# Altium project STM3205P.PrjPcb
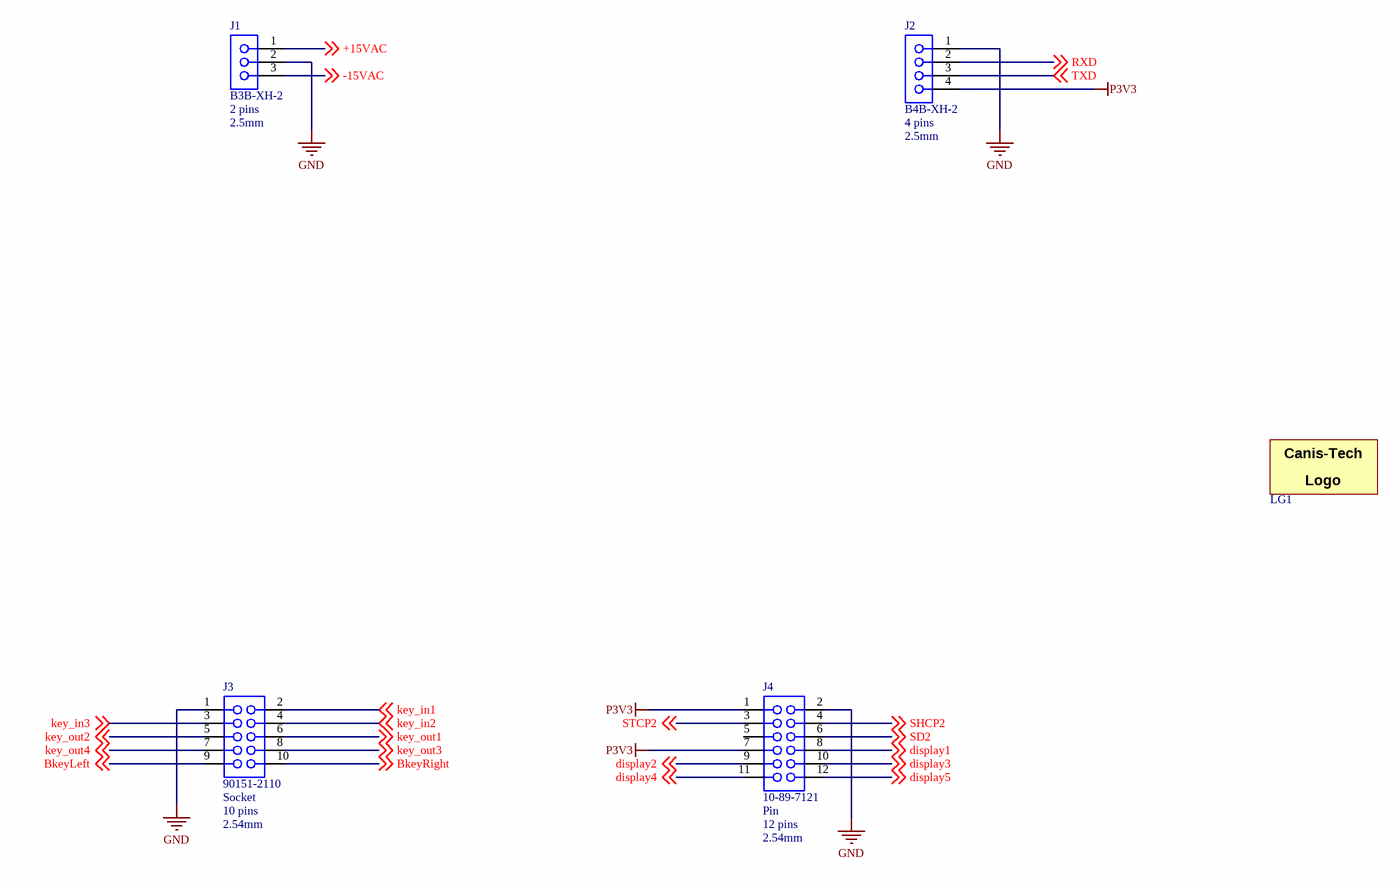
[diagram p0: STM3205P_Connectors.SchDoc]
_Revision: 1.1; _ProjectName: STM3205P; _Engineer: Lucas da Silva; _DrawnBy: Lucas da Silva; _Author: Lucas da Silva; POName: STM3205P
9 sheets, 101 parts. Net scope: global (net labels, ports and power ports of the same name join across sheets).
Board file: STM3205P_PCB.PcbDoc
Sheets:
  STM3205P_Title.SchDoc
  STM3205P_Connectors.SchDoc
  STM3205P_PowerSupply.SchDoc
  STM3205P_Controller.SchDoc
  STM3205P_DACSPI.SchDoc
  STM3205P_VoltageMeasure.SchDoc
  STM3205P_CurrentMeasure.SchDoc
  STM3205P_VoltageControl.SchDoc
  STM3205P_DigitalOutputs.SchDoc

## Sheet STM3205P_Title.SchDoc: =_ProjectName
size A3; Author: Lucas da Silva; DrawnBy: Lucas da Silva; Engineer: Lucas da Silva; Organization: Canis Tech; Address1: -; Address2: -; Address3: -; Address4: Indaiatuba/SP; DocumentNumber: 1; Revision: 1.1; SheetNumber: 1; SheetTotal: 9; Address5: Brazil

### Notes on the sheet
- Rev.
- Description
- Date
- Author
- Page
- Schematic Page
- 1.0
- Project kickoff
- 1
- Title page
- Title
- Checked By
- Variant
- Size:
- Revision:
- A3
- Date:
- Project
- Time:
- Sheet
- of
- File:

## Sheet STM3205P_Connectors.SchDoc
size A3; Author: Lucas da Silva; DrawnBy: Lucas da Silva; Engineer: Lucas da Silva; Organization: Canis Tech; Address1: -; Address2: -; Address3: -; Address4: Indaiatuba/SP; DocumentNumber: 2; Revision: 1.1; SheetNumber: 2; SheetTotal: 9; Address5: Brazil

### Parts
J1  Pins: 2 pins  Pitch: 2.5mm  [CONXH03STRMALE_2.5]  (hidden comment: B3B-XH-2)
J2  Pins: 4 pins  Pitch: 2.5mm  [CONXH04STRMALE_2.5]  (hidden comment: B4B-XH-2)
J3  Type: Socket  Pins: 10 pins  Pitch: 2.54mm  [CONDIL10STRFEMALE_100_100]  (hidden comment: 90151-2110)
J4  Type: Pin  Pins: 12 pins  Pitch: 2.54mm  [CONDIL12STRMALE_100_100]  (hidden comment: 10-89-7121)
LG1  Canis-Tech Logo  [CT Logo 400th]  (value not drawn)  (no BOM)

### Nets
GND: J1.2 J2.1 J3.1 J4.2
P3V3: J2.4 J4.1 J4.7
+15VAC: J1.1 ; off-sheet +15VAC
-15VAC: J1.3 ; off-sheet -15VAC
BkeyLeft: J3.9 ; off-sheet BkeyLeft
BkeyRight: J3.10 ; off-sheet BkeyRight
display1: J4.8 ; off-sheet display1
display2: J4.9 ; off-sheet display2
display3: J4.10 ; off-sheet display3
display4: J4.11 ; off-sheet display4
display5: J4.12 ; off-sheet display5
key_in1: J3.2 ; off-sheet key_in1
key_in2: J3.4 ; off-sheet key_in2
key_in3: J3.3 ; off-sheet key_in3
key_out1: J3.6 ; off-sheet key_out1
key_out2: J3.5 ; off-sheet key_out2
key_out3: J3.8 ; off-sheet key_out3
key_out4: J3.7 ; off-sheet key_out4
RXD: J2.2 ; off-sheet RXD
SD2: J4.6 ; off-sheet SD2
SHCP2: J4.4 ; off-sheet SHCP2
STCP2: J4.3 ; off-sheet STCP2
TXD: J2.3 ; off-sheet TXD

Not connected (* = marked no-connect by the designer): J4 5

### Notes on the sheet
- Title
- Author
- Checked By
- Variant
- Size:
- Revision:
- A3
- Date:
- Project
- Time:
- Sheet
- of
- File:
- (in symbol Canis-Tech Logo) Canis-Tech; Logo

### Library data of the parts
J1 = B3B-XH-2: XH Connector 3 POS HDR VERT 2.5mm; Manufacturer1: JST; LastRevisionNote: Created; Gender: Male; Published: 04-Oct-2025; LatestRevisionDate: 04-Oct-2025; PackageReference: CONXH03STRMALE_2.5; Publisher: Lucas Moraes; PackageDescription: CONXH03STRMALE_2.5; 3 Leads; Type: Pin; PartNumber1: B3B-XH-2
J2 = B4B-XH-2: XH Connector 4 POS HDR VERT 2.5mm; Manufacturer1: JST; LastRevisionNote: Created; Gender: Male; Published: 04-Oct-2025; LatestRevisionDate: 04-Oct-2025; PackageReference: CONXH04STRMALE_2.5; Publisher: Lucas Moraes; PackageDescription: CONXH04STRMALE_2.5; 4 Leads; Type: Pin; PartNumber1: B4B-XH-2
J3 = 90151-2110: Headers & Wire Housings C-Grid PCB Conn Dual Row Vertical 10Ckt; Manufacturer1: Molex; LastRevisionNote: Created; Gender: Female; Direction: 90; Published: 03-Jan-2025; LatestRevisionDate: 03-Jan-2025; PackageReference: CONDIL10STRFEMALE_100_100; Publisher: Lucas Moraes; PackageDescription: CONDIL10STRFEMALE_100_100; 10 Leads; PartNumber1: 90151-2110
J4 = 10-89-7121: Headers & Wire Housings C-Grid PCB Conn SR V onn SR Vt Tn-A 12Ckt; Manufacturer1: Molex; LastRevisionNote: Created; Gender: Male; Direction: 180; Published: 15-Sep-2017; LatestRevisionDate: 15-Sep-2017; PackageReference: CONDIL12; Publisher: Lucas Moraes; PackageDescription: CONDIL12; 12 Leads; PartNumber1: 10-89-7121
LG1 = Canis-Tech Logo: Published: 14-Jul-2023; LatestRevisionDate: 14-Jul-2023; PackageReference: SEW Logo 100th; Publisher: Lucas Moraes; PackageDescription: SEW Logo 100th; No Leads

## Sheet STM3205P_PowerSupply.SchDoc
size A3; Author: Lucas da Silva; DrawnBy: Lucas da Silva; Engineer: Lucas da Silva; Organization: Canis Tech; Address1: -; Address2: -; Address3: -; Address4: Indaiatuba/SP; DocumentNumber: 3; Revision: 1.1; SheetNumber: 3; SheetTotal: 9; Address5: Brazil
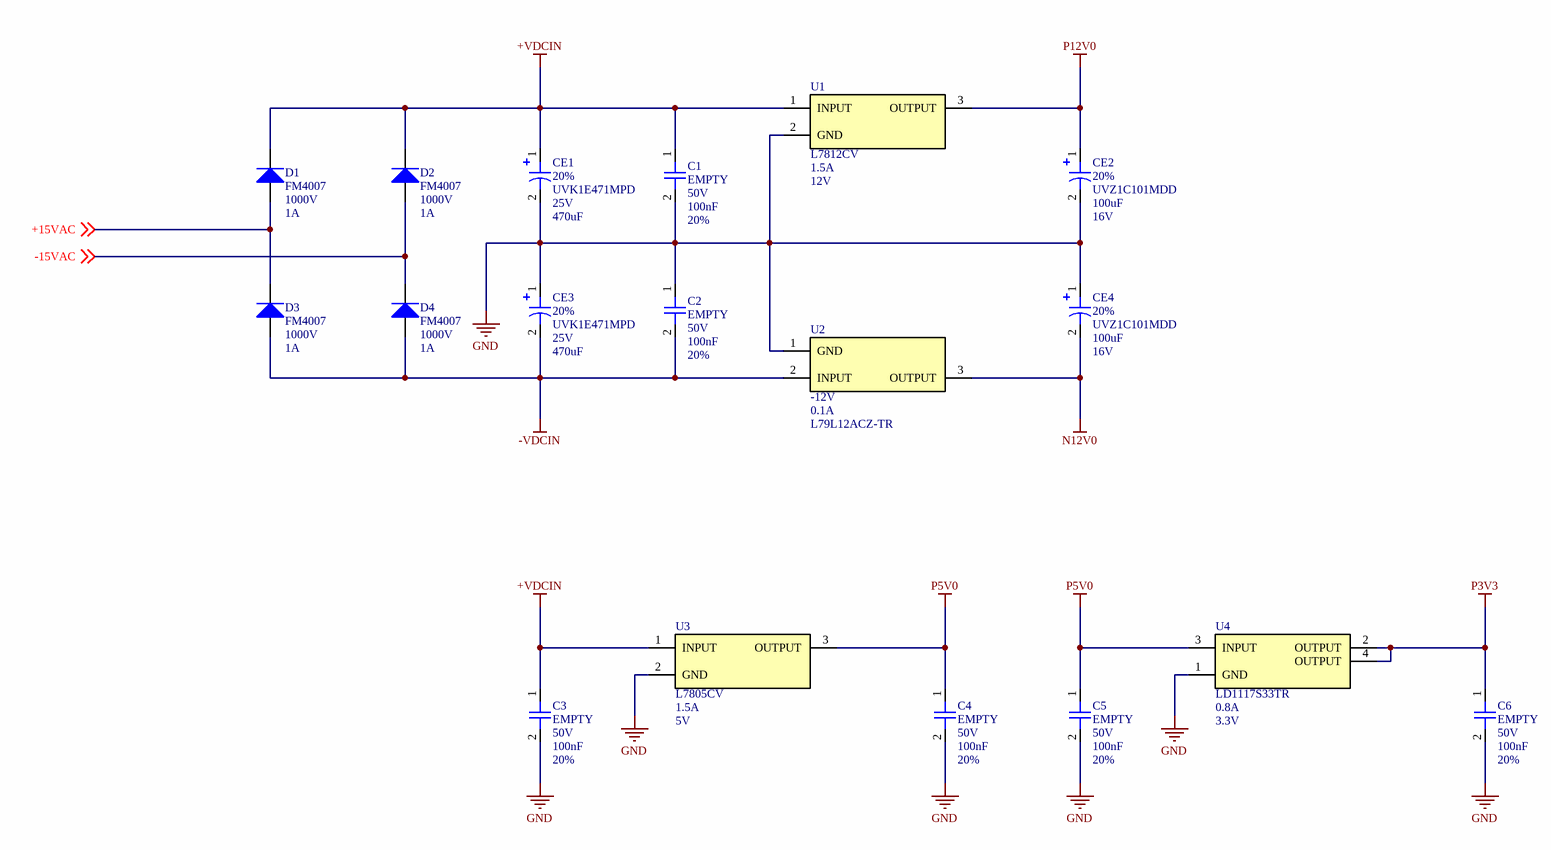
[diagram p1: STM3205P_PowerSupply.SchDoc]

### Parts
C1  value 100nF  PartNumber1: EMPTY  Voltage: 50V  Tolerance: 20%  [CAP0603]  (hidden comment: CC0603)
C2  value 100nF  PartNumber1: EMPTY  Voltage: 50V  Tolerance: 20%  [CAP0603]  (hidden comment: CC0603)
C3  value 100nF  PartNumber1: EMPTY  Voltage: 50V  Tolerance: 20%  [CAP0603]  (hidden comment: CC0603)
C4  value 100nF  PartNumber1: EMPTY  Voltage: 50V  Tolerance: 20%  [CAP0603]  (hidden comment: CC0603)
C5  value 100nF  PartNumber1: EMPTY  Voltage: 50V  Tolerance: 20%  [CAP0603]  (hidden comment: CC0603)
C6  value 100nF  PartNumber1: EMPTY  Voltage: 50V  Tolerance: 20%  [CAP0603]  (hidden comment: CC0603)
CE1  value 470uF  Tolerance: 20%  PartNumber1: UVK1E471MPD  Voltage: 25V  [5.0-10.0-12.5]  (hidden comment: 25V 470uF)
CE2  value 100uF  Tolerance: 20%  PartNumber1: UVZ1C101MDD  Voltage: 16V  [2.0-5.0-11.0]  (hidden comment: 16V 100uF)
CE3  value 470uF  Tolerance: 20%  PartNumber1: UVK1E471MPD  Voltage: 25V  [5.0-10.0-12.5]  (hidden comment: 25V 470uF)
CE4  value 100uF  Tolerance: 20%  PartNumber1: UVZ1C101MDD  Voltage: 16V  [2.0-5.0-11.0]  (hidden comment: 16V 100uF)
D1  Vrrm: 1000V  If: 1A  [DO-214AC]  (hidden comment: FM4007)
D2  Vrrm: 1000V  If: 1A  [DO-214AC]  (hidden comment: FM4007)
D3  Vrrm: 1000V  If: 1A  [DO-214AC]  (hidden comment: FM4007)
D4  Vrrm: 1000V  If: 1A  [DO-214AC]  (hidden comment: FM4007)
U1  Current: 1.5A  Voltage: 12V  [TO-220A]  (hidden comment: L7812CV)
U2  Voltage: -12V  Current: 0.1A  [TO-92A_2.5]  (hidden comment: L79L12ACZ-TR)
U3  Current: 1.5A  Voltage: 5V  [TO-220A]  (hidden comment: L7805CV)
U4  Current: 0.8A  Voltage: 3.3V  [SOT-223]  (hidden comment: LD1117S33TR)

### Nets
+VDCIN: C1.1 C3.1 CE1.1 D1.K D2.K U1.1(INPUT) U3.1(INPUT)
-VDCIN: C2.2 CE3.2 D3.A D4.A U2.2(INPUT)
GND: C1.2 C2.1 C3.2 C4.2 C5.2 C6.2 CE1.2 CE2.2 CE3.1 CE4.1 U1.2(GND) U2.1(GND) U3.2(GND) U4.1(GND)
N12V0: CE4.2 U2.3(OUTPUT)
P3V3: C6.1 U4.2(OUTPUT) U4.4(OUTPUT)
P5V0: C4.1 C5.1 U3.3(OUTPUT) U4.3(INPUT)
P12V0: CE2.1 U1.3(OUTPUT)
+15VAC: D1.A D3.K ; off-sheet +15VAC
-15VAC: D2.A D4.K ; off-sheet -15VAC

### Notes on the sheet
- Title
- Author
- Checked By
- Variant
- Size:
- Revision:
- A3
- Date:
- Project
- Time:
- Sheet
- of
- File:

### Library data of the parts
C1-C6 = CC0603: Surface Mount Multilayer Ceramic Chip Capacitors  for Commercial Applications; Manufacturer1: Yageo; Published: 19-Jun-2016; LatestRevisionDate: 19-Jun-2016; Publisher: Lucas Moraes; PackageReference: CAP0603; PackageDescription: CAP0603;2 Leads
CE1 CE3 = 25V 470uF: Electrolytic Capacitor PTH; Manufacturer1: Nichicon; Code: 471; Published: 24-Aug-2025; LatestRevisionDate: 24-Aug-2025; Publisher: Lucas Moraes; LatestRevisionNote: Created; PackageReference: 5.0-10.0-12.5; PackageDescription: 5.0-10.0-12.5;2 Leads
CE2 CE4 = 16V 100uF: Electrolytic Capacitor PTH; Manufacturer1: Nichicon; Code: 101; Published: 26-Dec-2016; LatestRevisionDate: 26-Dec-2016; PackageReference: 2-5; Publisher: Lucas Moraes; PackageDescription: 2-5;2 leads; LatestRevisionNote: Created
D1-D4 = FM4007: General Purpose Plastic Rectifier; Manufacturer1: Rectron; Vf: 1.1V; Published: 25-Feb-2019; LatestRevisionDate: 25-Feb-2019; PackageReference: DO-214AC; Publisher: Lucas Moraes; PackageDescription: DO-214AC; 2 Leads; PartNumber1: FM4007
U1 = L7812CV: Positive voltage regulator ICs; Manufacturer1: STMicroelectronics; Published: 29-May-2016; LatestRevisionDate: 25-Jun-2023; LatestRevisionNote: Created; PackageReference: TO220A; Publisher: Lucas Moraes; PackageDescription: TO220A;3 Leads; PartNumber1: L7812CV
U2 = L79L12ACZ-TR: Negative voltage regulator ICs; Manufacturer1: STMicroelectronics; Published: 17-Aug-2025; LatestRevisionDate: 17-Aug-2025; LatestRevisionNote: Created; PackageReference: TO-92; Publisher: Lucas Moraes; PackageDescription: TO-92;3 Leads; PartNumber1: L79L12ACZ-TR
U3 = L7805CV: Positive voltage regulator ICs; Manufacturer1: STMicroelectronics; Published: 29-May-2016; LatestRevisionDate: 25-Jun-2023; LatestRevisionNote: Created; PackageReference: TO220A; Publisher: Lucas Moraes; PackageDescription: TO220A;3 Leads; PartNumber1: L7805CV
U4 = LD1117S33TR: Positive voltage regulator ICs; Manufacturer1: STMicroelectronics; Published: 20-Sep-2019; LatestRevisionDate: 20-Sep-2019; LatestRevisionNote: Created; PackageReference: SOT-223; Publisher: Lucas Moraes; PackageDescription: SOT-223;3 Leads; PartNumber1: LD1117S33TR

## Sheet STM3205P_Controller.SchDoc
size A3; Author: Lucas da Silva; DrawnBy: Lucas da Silva; Engineer: Lucas da Silva; Organization: Canis Tech; Address1: -; Address2: -; Address3: -; Address4: Indaiatuba/SP; DocumentNumber: 4; Revision: 1.1; SheetNumber: 4; SheetTotal: 9; Address5: Brazil
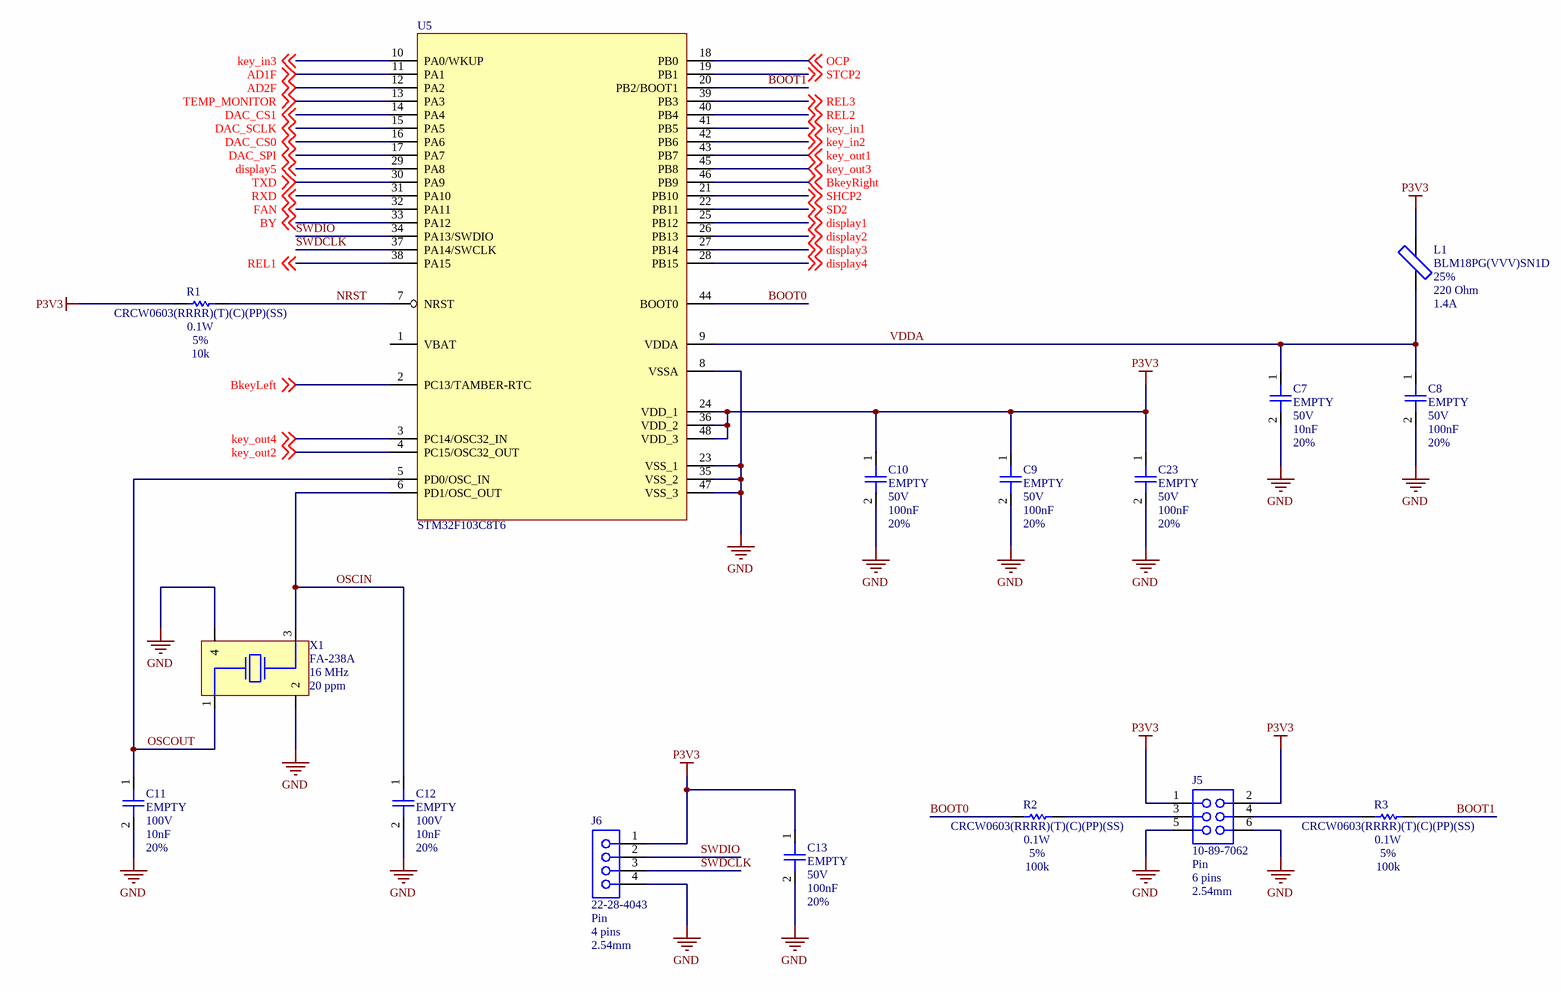
[diagram p2: STM3205P_Controller.SchDoc]

### Parts
C7  value 10nF  PartNumber1: EMPTY  Voltage: 50V  Tolerance: 20%  [CAP0603]  (hidden comment: CC0603)
C8  value 100nF  PartNumber1: EMPTY  Voltage: 50V  Tolerance: 20%  [CAP0603]  (hidden comment: CC0603)
C9  value 100nF  PartNumber1: EMPTY  Voltage: 50V  Tolerance: 20%  [CAP0603]  (hidden comment: CC0603)
C10  value 100nF  PartNumber1: EMPTY  Voltage: 50V  Tolerance: 20%  [CAP0603]  (hidden comment: CC0603)
C11  value 10nF  PartNumber1: EMPTY  Voltage: 100V  Tolerance: 20%  [CAP0603]  (hidden comment: CC0603)
C12  value 10nF  PartNumber1: EMPTY  Voltage: 100V  Tolerance: 20%  [CAP0603]  (hidden comment: CC0603)
C13  value 100nF  PartNumber1: EMPTY  Voltage: 50V  Tolerance: 20%  [CAP0603]  (hidden comment: CC0603)
C23  value 100nF  PartNumber1: EMPTY  Voltage: 50V  Tolerance: 20%  [CAP0603]  (hidden comment: CC0603)
J5  Type: Pin  Pins: 6 pins  Pitch: 2.54mm  [CONDIL06STRMALE_100_100]  (hidden comment: 10-89-7062)
J6  Type: Pin  Pins: 4 pins  Pitch: 2.54mm  [CONSIL04STRMALE_100_100]  (hidden comment: 22-28-4043)
L1  value 220 Ohm  PartNumber1: BLM18PG(VVV)SN1D  Tolerance: 25%  Current: 1.4A  [IND0603]  (hidden comment: BLM18)
R1  value 10k  PartNumber1: CRCW0603(RRRR)(T)(C)(PP)(SS)  Power: 0.1W  Tolerance: 5%  [RES0603]  (hidden comment: Chip Resistor)
R2  value 100k  PartNumber1: CRCW0603(RRRR)(T)(C)(PP)(SS)  Power: 0.1W  Tolerance: 5%  [RES0603]  (hidden comment: Chip Resistor)
R3  value 100k  PartNumber1: CRCW0603(RRRR)(T)(C)(PP)(SS)  Power: 0.1W  Tolerance: 5%  [RES0603]  (hidden comment: Chip Resistor)
U5  STM32F103C8T6  [LQFP-48]
X1  value 16 MHz  Tolerance: 20 ppm  [CR3225]  (hidden comment: FA-238A)

### Nets
GND: C7.2 C8.2 C9.2 C10.2 C11.2 C12.2 C13.2 C23.2 J5.5 J5.6 J6.4 U5.8(VSSA) U5.23(VSS_1) U5.35(VSS_2) U5.47(VSS_3) X1.2 X1.4
P3V3: C9.1 C10.1 C13.1 C23.1 J5.1 J5.2 J6.1 L1.2 R1.1 U5.24(VDD_1) U5.36(VDD_2) U5.48(VDD_3)
AD1F: U5.11(PA1) ; off-sheet AD1F
AD2F: U5.12(PA2) ; off-sheet AD2F
BkeyLeft: U5.2(PC13/TAMBER-RTC) ; off-sheet BkeyLeft
BkeyRight: U5.46(PB9) ; off-sheet BkeyRight
BOOT0: R2.1 U5.44(BOOT0)
BOOT1: R3.2 U5.20(PB2/BOOT1)
BY: U5.33(PA12) ; off-sheet BY
DAC_CS0: U5.16(PA6) ; off-sheet DAC_CS0
DAC_CS1: U5.14(PA4) ; off-sheet DAC_CS1
DAC_SCLK: U5.15(PA5) ; off-sheet DAC_SCLK
DAC_SPI: U5.17(PA7) ; off-sheet DAC_SPI
display1: U5.25(PB12) ; off-sheet display1
display2: U5.26(PB13) ; off-sheet display2
display3: U5.27(PB14) ; off-sheet display3
display4: U5.28(PB15) ; off-sheet display4
display5: U5.29(PA8) ; off-sheet display5
FAN: U5.32(PA11) ; off-sheet FAN
key_in1: U5.41(PB5) ; off-sheet key_in1
key_in2: U5.42(PB6) ; off-sheet key_in2
key_in3: U5.10(PA0/WKUP) ; off-sheet key_in3
key_out1: U5.43(PB7) ; off-sheet key_out1
key_out2: U5.4(PC15/OSC32_OUT) ; off-sheet key_out2
key_out3: U5.45(PB8) ; off-sheet key_out3
key_out4: U5.3(PC14/OSC32_IN) ; off-sheet key_out4
NRST: R1.2 U5.7(NRST)
OCP: U5.18(PB0) ; off-sheet OCP
OSCIN: C12.1 U5.6(PD1/OSC_OUT) X1.3
OSCOUT: C11.1 U5.5(PD0/OSC_IN) X1.1
REL1: U5.38(PA15) ; off-sheet REL1
REL2: U5.40(PB4) ; off-sheet REL2
REL3: U5.39(PB3) ; off-sheet REL3
RXD: U5.31(PA10) ; off-sheet RXD
SD2: U5.22(PB11) ; off-sheet SD2
SHCP2: U5.21(PB10) ; off-sheet SHCP2
STCP2: U5.19(PB1) ; off-sheet STCP2
SWDCLK: J6.3 U5.37(PA14/SWCLK)
SWDIO: J6.2 U5.34(PA13/SWDIO)
TEMP_MONITOR: U5.13(PA3) ; off-sheet TEMP_MONITOR
TXD: U5.30(PA9) ; off-sheet TXD
VDDA: C7.1 C8.1 L1.1 U5.9(VDDA)
NetJ5_3: J5.3 R2.2
NetJ5_4: J5.4 R3.1

Not connected (* = marked no-connect by the designer): U5 1(VBAT)

### Notes on the sheet
- Title
- Author
- Checked By
- Variant
- Size:
- Revision:
- A3
- Date:
- Project
- Time:
- Sheet
- of
- File:

### Library data of the parts
C7-C13 C23 = CC0603: as C1 on sheet STM3205P_PowerSupply; Published: 19-Jun-2016; LatestRevisionDate: 19-Jun-2016; Publisher: Lucas Moraes; PackageReference: CAP0603; PackageDescription: CAP0603;2 Leads
J5 = 10-89-7062: Headers & Wire Housings C-Grid PCB Conn SR V onn SR Vt Tn-A 8Ckt; Manufacturer1: Molex; LastRevisionNote: Created; Gender: Male; Direction: 180; Published: 12-Sep-2017; LatestRevisionDate: 12-Sep-2017; PackageReference: CONDIL6; Publisher: Lucas Moraes; PackageDescription: CONDIL6; 6 Leads; PartNumber1: 10-89-7062
J6 = 22-28-4043: Headers & Wire Housings 04 MODII HDR SRST B/A .100CL; Manufacturer1: Molex; LastRevisionNote: Created; Gender: Male; Published: 27-Mar-2023; LatestRevisionDate: 27-Mar-2023; PackageReference: CONSIL04STRMALE_100_100; Publisher: Lucas Moraes; PackageDescription: CONSIL04STRMALE_100_100; 4 Leads; PartNumber1: 22-28-4043
L1 = BLM18: Ferrite Beads 0603; Manufacturer1: Murata Electronics; Code: 221; LatestRevisionDate: 22-Dec-2016; PackageReference: IND0603; Publisher: Lucas Moraes; PackageDescription: IND0603; 2 Leads; Published: 22-Dec-2016
R1-R3 = CRCW0603: Thick Film Chip Resistors with CECC Approval,  available with Established Reliability; Manufacturer1: Vishay; LatestRevisionDate: 06-May-2016; PackageReference: 0603; Publisher: Lucas Moraes; PackageDescription: SMD 0603; 2 Leads; Published: 06-May-2016
U5 = STM32F103C8T6: 32-bit Microcontrollers - ARM Cortex-M0+ 32kB Flash, 6kB RAM; Manufacturer1: STMicroelectronics; Published: 01-May-2024; LatestRevisionDate: 01-May-2024; LatestRevisionNote: Created; PackageReference: LQFP-48; Publisher: Lucas Moraes; PackageDescription: LQFP-48; 48 leads; PartNumber1: STM32F103C8T6
X1 = FA-238A: Crystals FA-238A XTAL MHZ -40 125C 7.0PF 250TR; Manufacturer1: Epson Timing; Published: 03-Dec-2021; LatestRevisionDate: 03-Dec-2021; Publisher: Lucas Moraes; PackageReference: FA-238A; PackageDescription: FA-238A;2 Leads; Datasheet: https://br.mouser.com/datasheet/2/137/FA_238A_en-1649567.pdf; PartNumber1: FA-238A

## Sheet STM3205P_DACSPI.SchDoc
size A3; Author: Lucas da Silva; DrawnBy: Lucas da Silva; Engineer: Lucas da Silva; Organization: Canis Tech; Address1: -; Address2: -; Address3: -; Address4: Indaiatuba/SP; DocumentNumber: 5; Revision: 1.1; SheetNumber: 5; SheetTotal: 9; Address5: Brazil
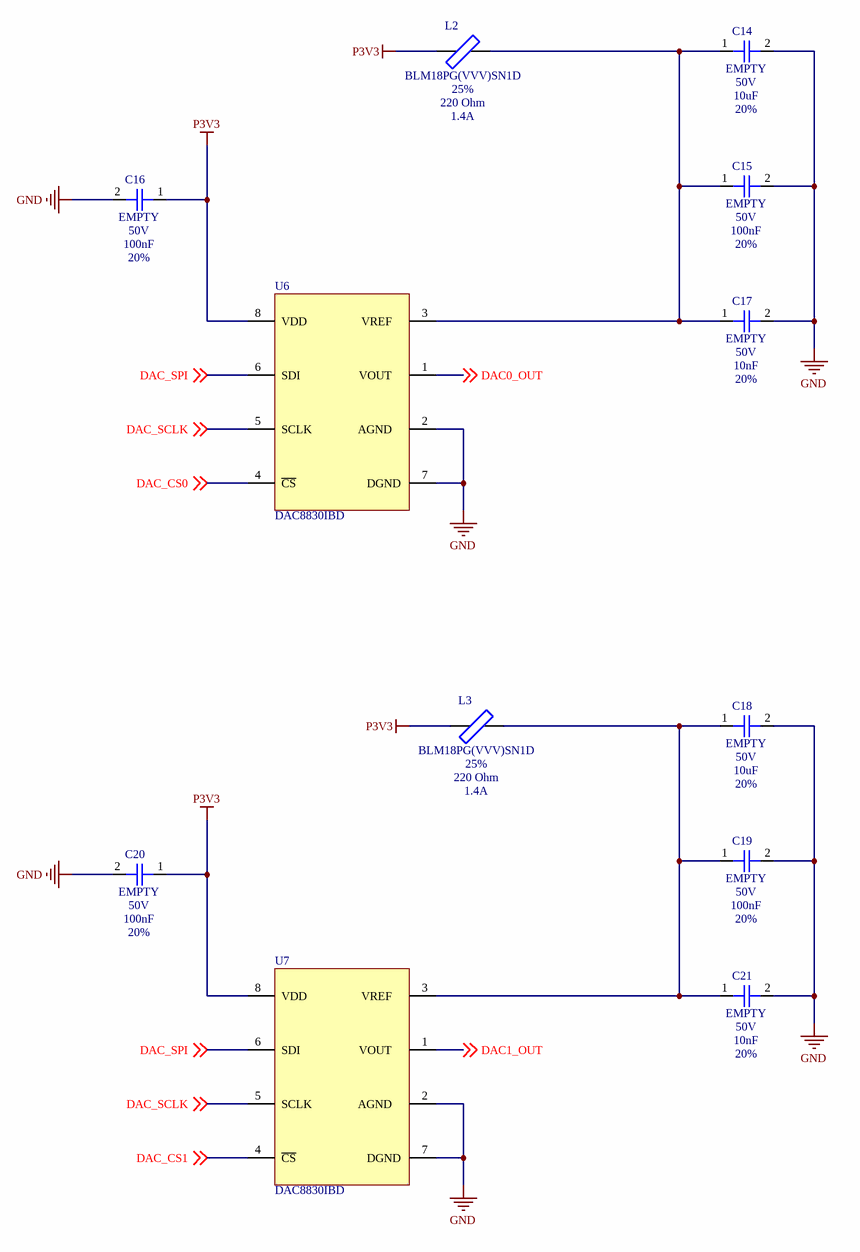
[diagram p3: STM3205P_DACSPI.SchDoc]

### Parts
C14  value 10uF  PartNumber1: EMPTY  Voltage: 50V  Tolerance: 20%  [CAP0603]  (hidden comment: CC0603)
C15  value 100nF  PartNumber1: EMPTY  Voltage: 50V  Tolerance: 20%  [CAP0603]  (hidden comment: CC0603)
C16  value 100nF  PartNumber1: EMPTY  Voltage: 50V  Tolerance: 20%  [CAP0603]  (hidden comment: CC0603)
C17  value 10nF  PartNumber1: EMPTY  Voltage: 50V  Tolerance: 20%  [CAP0603]  (hidden comment: CC0603)
C18  value 10uF  PartNumber1: EMPTY  Voltage: 50V  Tolerance: 20%  [CAP0603]  (hidden comment: CC0603)
C19  value 100nF  PartNumber1: EMPTY  Voltage: 50V  Tolerance: 20%  [CAP0603]  (hidden comment: CC0603)
C20  value 100nF  PartNumber1: EMPTY  Voltage: 50V  Tolerance: 20%  [CAP0603]  (hidden comment: CC0603)
C21  value 10nF  PartNumber1: EMPTY  Voltage: 50V  Tolerance: 20%  [CAP0603]  (hidden comment: CC0603)
L2  value 220 Ohm  PartNumber1: BLM18PG(VVV)SN1D  Tolerance: 25%  Current: 1.4A  [IND0603]  (hidden comment: BLM18)
L3  value 220 Ohm  PartNumber1: BLM18PG(VVV)SN1D  Tolerance: 25%  Current: 1.4A  [IND0603]  (hidden comment: BLM18)
U6  PartNumber1: DAC8830IBD  [SOIC-08-3.9mm]  (hidden comment: DAC8830ICD)
U7  PartNumber1: DAC8830IBD  [SOIC-08-3.9mm]  (hidden comment: DAC8830ICD)

### Nets
GND: C14.2 C15.2 C16.2 C17.2 C18.2 C19.2 C20.2 C21.2 U6.2(AGND) U6.7(DGND) U7.2(AGND) U7.7(DGND)
P3V3: C16.1 C20.1 L2.2 L3.2 U6.8(VDD) U7.8(VDD)
DAC0_OUT: U6.1(VOUT) ; off-sheet DAC0_OUT
DAC1_OUT: U7.1(VOUT) ; off-sheet DAC1_OUT
DAC_CS0: U6.4(~{CS}) ; off-sheet DAC_CS0
DAC_CS1: U7.4(~{CS}) ; off-sheet DAC_CS1
DAC_SCLK: U6.5(SCLK) U7.5(SCLK) ; off-sheet DAC_SCLK
DAC_SPI: U6.6(SDI) U7.6(SDI) ; off-sheet DAC_SPI
NetC14_1: C14.1 C15.1 C17.1 L2.1 U6.3(VREF)
NetC18_1: C18.1 C19.1 C21.1 L3.1 U7.3(VREF)

### Notes on the sheet
- Title
- Author
- Checked By
- Variant
- Size:
- Revision:
- A3
- Date:
- Project
- Time:
- Sheet
- of
- File:

### Library data of the parts
C14-C21 = CC0603: as C1 on sheet STM3205P_PowerSupply; Published: 19-Jun-2016; LatestRevisionDate: 19-Jun-2016; Publisher: Lucas Moraes; PackageReference: CAP0603; PackageDescription: CAP0603;2 Leads
L2 L3 = BLM18: as L1 on sheet STM3205P_Controller; LatestRevisionDate: 22-Dec-2016; PackageReference: IND0603; Publisher: Lucas Moraes; PackageDescription: IND0603; 2 Leads; Published: 22-Dec-2016
U6 U7 = DAC8830ICD: DAC Lo-Pwr R-To-R Output 16-Bit Serial Input; Manufacturer1: Texas Instruments; Published: 02-Apr-2025; LatestRevisionDate: 02-Apr-2025; LatestRevisionNote: Created; PackageReference: SOIC-08-3.9mm; Publisher: Lucas Moraes; PackageDescription: SOIC-08-3.9mm; 8 Leads; Datasheet: https://www.ti.com/lit/ds/symlink/dac8830.pdf

## Sheet STM3205P_VoltageMeasure.SchDoc
size A3; Author: Lucas da Silva; DrawnBy: Lucas da Silva; Engineer: Lucas da Silva; Organization: Canis Tech; Address1: -; Address2: -; Address3: -; Address4: Indaiatuba/SP; DocumentNumber: 6; Revision: 1.1; SheetNumber: 6; SheetTotal: 9; Address5: Brazil
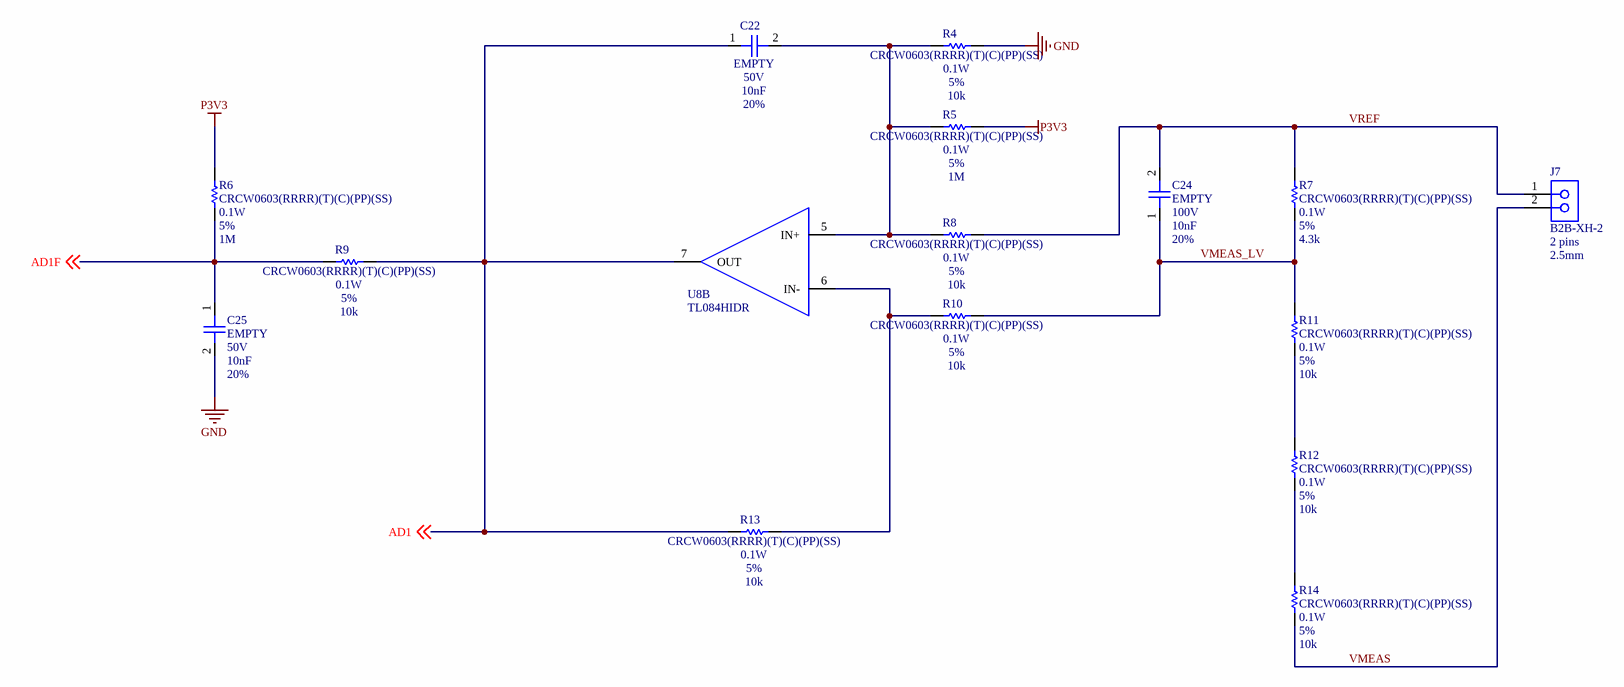
[diagram p4: STM3205P_VoltageMeasure.SchDoc]

### Parts
C22  value 10nF  PartNumber1: EMPTY  Voltage: 50V  Tolerance: 20%  [CAP0603]  (hidden comment: CC0603)
C24  value 10nF  PartNumber1: EMPTY  Voltage: 100V  Tolerance: 20%  [CAP0603]  (hidden comment: CC0603)
C25  value 10nF  PartNumber1: EMPTY  Voltage: 50V  Tolerance: 20%  [CAP0603]  (hidden comment: CC0603)
J7  Pins: 2 pins  Pitch: 2.5mm  [CONXH02STRMALE_2.5]  (hidden comment: B2B-XH-2)
R4  value 10k  PartNumber1: CRCW0603(RRRR)(T)(C)(PP)(SS)  Power: 0.1W  Tolerance: 5%  [RES0603]  (hidden comment: Chip Resistor)
R5  value 1M  PartNumber1: CRCW0603(RRRR)(T)(C)(PP)(SS)  Power: 0.1W  Tolerance: 5%  [RES0603]  (hidden comment: Chip Resistor)
R6  value 1M  PartNumber1: CRCW0603(RRRR)(T)(C)(PP)(SS)  Power: 0.1W  Tolerance: 5%  [RES0603]  (hidden comment: Chip Resistor)
R7  value 4.3k  PartNumber1: CRCW0603(RRRR)(T)(C)(PP)(SS)  Power: 0.1W  Tolerance: 5%  [RES0603]  (hidden comment: Chip Resistor)
R8  value 10k  PartNumber1: CRCW0603(RRRR)(T)(C)(PP)(SS)  Power: 0.1W  Tolerance: 5%  [RES0603]  (hidden comment: Chip Resistor)
R9  value 10k  PartNumber1: CRCW0603(RRRR)(T)(C)(PP)(SS)  Power: 0.1W  Tolerance: 5%  [RES0603]  (hidden comment: Chip Resistor)
R10  value 10k  PartNumber1: CRCW0603(RRRR)(T)(C)(PP)(SS)  Power: 0.1W  Tolerance: 5%  [RES0603]  (hidden comment: Chip Resistor)
R11  value 10k  PartNumber1: CRCW0603(RRRR)(T)(C)(PP)(SS)  Power: 0.1W  Tolerance: 5%  [RES0603]  (hidden comment: Chip Resistor)
R12  value 10k  PartNumber1: CRCW0603(RRRR)(T)(C)(PP)(SS)  Power: 0.1W  Tolerance: 5%  [RES0603]  (hidden comment: Chip Resistor)
R13  value 10k  PartNumber1: CRCW0603(RRRR)(T)(C)(PP)(SS)  Power: 0.1W  Tolerance: 5%  [RES0603]  (hidden comment: Chip Resistor)
R14  value 10k  PartNumber1: CRCW0603(RRRR)(T)(C)(PP)(SS)  Power: 0.1W  Tolerance: 5%  [RES0603]  (hidden comment: Chip Resistor)
U8  TL084HIDR  [SOIC-14-3.9mm]  (part B of 4)

### Nets
GND: C25.2 R4.2
P3V3: R5.2 R6.2
AD1: C22.1 R9.2 R13.1 U8.7(OUT) ; off-sheet AD1
AD1F: C25.1 R6.1 R9.1 ; off-sheet AD1F
VMEAS: J7.2 R14.2
VMEAS_LV: C24.1 R7.2 R10.2 R11.1
VREF: C24.2 J7.1 R7.1 R8.2
NetC22_2: C22.2 R4.1 R5.1 R8.1 U8.5(IN+)
NetR10_1: R10.1 R13.2 U8.6(IN-)
NetR11_2: R11.2 R12.1
NetR12_2: R12.2 R14.1

### Notes on the sheet
- Title
- Author
- Checked By
- Variant
- Size:
- Revision:
- A3
- Date:
- Project
- Time:
- Sheet
- of
- File:

### Library data of the parts
C22 C24 C25 = CC0603: as C1 on sheet STM3205P_PowerSupply; Published: 19-Jun-2016; LatestRevisionDate: 19-Jun-2016; Publisher: Lucas Moraes; PackageReference: CAP0603; PackageDescription: CAP0603;2 Leads
J7 = B2B-XH-2: XH Connector 2 POS HDR VERT 2.5mm; Manufacturer1: JST; LastRevisionNote: Created; Gender: Male; Published: 04-Oct-2025; LatestRevisionDate: 04-Oct-2025; PackageReference: CONXH02STRMALE_2.5; Publisher: Lucas Moraes; PackageDescription: CONXH02STRMALE_2.5; 2 Leads; Type: Pin; PartNumber1: B2B-XH-2
R4-R14 = CRCW0603: as R1 on sheet STM3205P_Controller; LatestRevisionDate: 06-May-2016; PackageReference: 0603; Publisher: Lucas Moraes; PackageDescription: SMD 0603; 2 Leads; Published: 06-May-2016
U8 = TL084HIDR: Quad Operational Amplifiers RRIO; Manufacturer1: Texas Instruments; Published: 27-Aug-2025; LatestRevisionDate: 27-Aug-2025; LatestRevisionNote: Created; PackageReference: SOIC14; Publisher: Lucas Moraes; PackageDescription: SOIC14; 14 Leads; Datasheet: https://www.ti.com/lit/ds/symlink/tl084.pdf; PartNumber1: TL084HIDR

## Sheet STM3205P_CurrentMeasure.SchDoc
size A3; Author: Lucas da Silva; DrawnBy: Lucas da Silva; Engineer: Lucas da Silva; Organization: Canis Tech; Address1: -; Address2: -; Address3: -; Address4: Indaiatuba/SP; DocumentNumber: 7; Revision: 1.1; SheetNumber: 7; SheetTotal: 9; Address5: Brazil
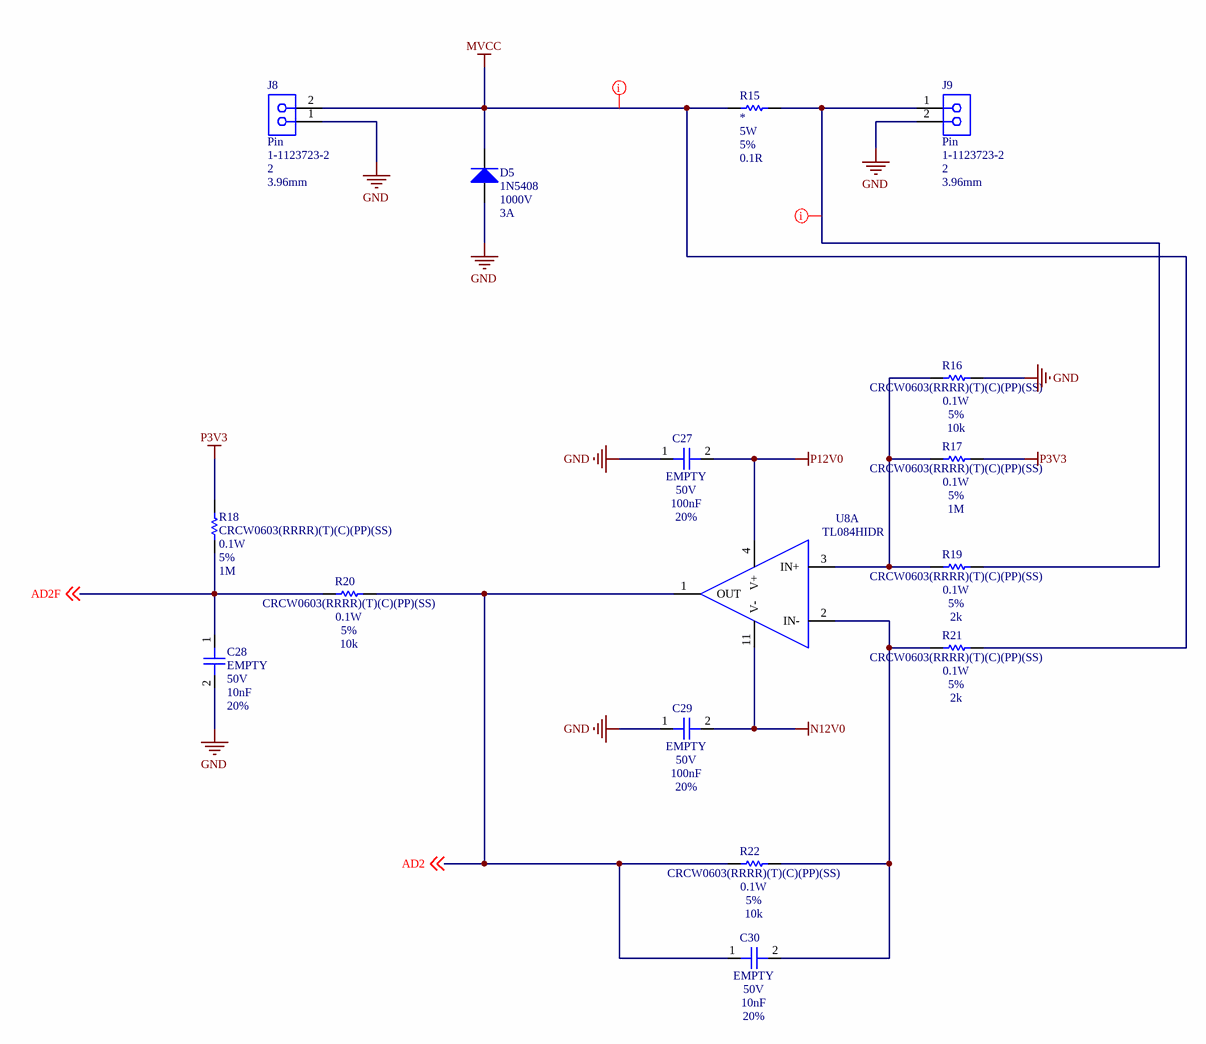
[diagram p5: STM3205P_CurrentMeasure.SchDoc]

### Parts
C27  value 100nF  PartNumber1: EMPTY  Voltage: 50V  Tolerance: 20%  [CAP0603]  (hidden comment: CC0603)
C28  value 10nF  PartNumber1: EMPTY  Voltage: 50V  Tolerance: 20%  [CAP0603]  (hidden comment: CC0603)
C29  value 100nF  PartNumber1: EMPTY  Voltage: 50V  Tolerance: 20%  [CAP0603]  (hidden comment: CC0603)
C30  value 10nF  PartNumber1: EMPTY  Voltage: 50V  Tolerance: 20%  [CAP0603]  (hidden comment: CC0603)
D5  Vrrm: 1000V  If: 3A  [DO-201AD]  (hidden comment: 1N5408)
J8  Type: Pin  Pins: 2  Pitch: 3.96mm  [CONKK02STRMALE_156]  (hidden comment: 1-1123723-2)
J9  Type: Pin  Pins: 2  Pitch: 3.96mm  [CONKK02STRMALE_156]  (hidden comment: 1-1123723-2)
R15  value 0.1R  Power: 5W  Tolerance: 5%  [RESSHUNT]  (hidden comment: Chip Resistor)
R16  value 10k  PartNumber1: CRCW0603(RRRR)(T)(C)(PP)(SS)  Power: 0.1W  Tolerance: 5%  [RES0603]  (hidden comment: Chip Resistor)
R17  value 1M  PartNumber1: CRCW0603(RRRR)(T)(C)(PP)(SS)  Power: 0.1W  Tolerance: 5%  [RES0603]  (hidden comment: Chip Resistor)
R18  value 1M  PartNumber1: CRCW0603(RRRR)(T)(C)(PP)(SS)  Power: 0.1W  Tolerance: 5%  [RES0603]  (hidden comment: Chip Resistor)
R19  value 2k  PartNumber1: CRCW0603(RRRR)(T)(C)(PP)(SS)  Power: 0.1W  Tolerance: 5%  [RES0603]  (hidden comment: Chip Resistor)
R20  value 10k  PartNumber1: CRCW0603(RRRR)(T)(C)(PP)(SS)  Power: 0.1W  Tolerance: 5%  [RES0603]  (hidden comment: Chip Resistor)
R21  value 2k  PartNumber1: CRCW0603(RRRR)(T)(C)(PP)(SS)  Power: 0.1W  Tolerance: 5%  [RES0603]  (hidden comment: Chip Resistor)
R22  value 10k  PartNumber1: CRCW0603(RRRR)(T)(C)(PP)(SS)  Power: 0.1W  Tolerance: 5%  [RES0603]  (hidden comment: Chip Resistor)
U8  TL084HIDR  [SOIC-14-3.9mm]  (part A of 4)

### Nets
GND: C27.1 C28.2 C29.1 D5.A J8.1 J9.2 R16.2
MVCC: D5.K J8.2 R15.2 R21.2
N12V0: C29.2 U8.11(V-)
P3V3: R17.2 R18.2
P12V0: C27.2 U8.4(V+)
AD2: C30.1 R20.2 R22.1 U8.1(OUT) ; off-sheet AD2
AD2F: C28.1 R18.1 R20.1 ; off-sheet AD2F
NetC30_2: C30.2 R21.1 R22.2 U8.2(IN-)
NetJ9_1: J9.1 R15.1 R19.2
NetR16_1: R16.1 R17.1 R19.1 U8.3(IN+)

### Layout directives
net class HighVoltage: MVCC, NetJ9_1

### Notes on the sheet
- Title
- Author
- Checked By
- Variant
- Size:
- Revision:
- A3
- Date:
- Project
- Time:
- Sheet
- of
- File:

### Library data of the parts
C27-C30 = CC0603: as C1 on sheet STM3205P_PowerSupply; Published: 19-Jun-2016; LatestRevisionDate: 19-Jun-2016; Publisher: Lucas Moraes; PackageReference: CAP0603; PackageDescription: CAP0603;2 Leads
D5 = 1N5408: Rectifiers Diode, 1000V, 3A; Manufacturer1: Diotec Semiconductor; Vf: 1.2V; Published: 26-Nov-2022; LatestRevisionDate: 26-Nov-2022; PackageReference: DO-201; Publisher: Lucas Moraes; PackageDescription: DO-201; 2 Leads; PartNumber1: 1N5408
J8 J9 = 1-1123723-2: Header Vert 3.96mm 2Pos; Manufacturer1: TE Connectivity; LastRevisionNote: Created; Gender: Male; Published: 16-Aug-2025; LatestRevisionDate: 16-Aug-2025; PackageReference: CONKK02STRMALE_156; Publisher: Lucas Moraes; PackageDescription: CONKK02STRMALE_156; 2 Leads; PartNumber1: 1-1123723-2
R15 = RESSHUNT: Thick Film Chip Resistors with CECC Approval,  available with Established Reliability; LatestRevisionDate: 18-Agu-2025; PackageReference: RESSHUNT; Publisher: Lucas Moraes; PackageDescription: RESSHUNT; 2 Leads; Published: 18-Agu-2025; Manufacturer1: *; PartNumber1: *
R16-R22 = CRCW0603: as R1 on sheet STM3205P_Controller; LatestRevisionDate: 06-May-2016; PackageReference: 0603; Publisher: Lucas Moraes; PackageDescription: SMD 0603; 2 Leads; Published: 06-May-2016
U8 = TL084HIDR: as U8 on sheet STM3205P_VoltageMeasure; Published: 27-Aug-2025; LatestRevisionDate: 27-Aug-2025; LatestRevisionNote: Created; PackageReference: SOIC14; Publisher: Lucas Moraes; PackageDescription: SOIC14; 14 Leads; Datasheet: https://www.ti.com/lit/ds/symlink/tl084.pdf; PartNumber1: TL084HIDR

## Sheet STM3205P_VoltageControl.SchDoc
size A3; Author: Lucas da Silva; DrawnBy: Lucas da Silva; Engineer: Lucas da Silva; Organization: Canis Tech; Address1: -; Address2: -; Address3: -; Address4: Indaiatuba/SP; DocumentNumber: 8; Revision: 1.1; SheetNumber: 8; SheetTotal: 9; Address5: Brazil
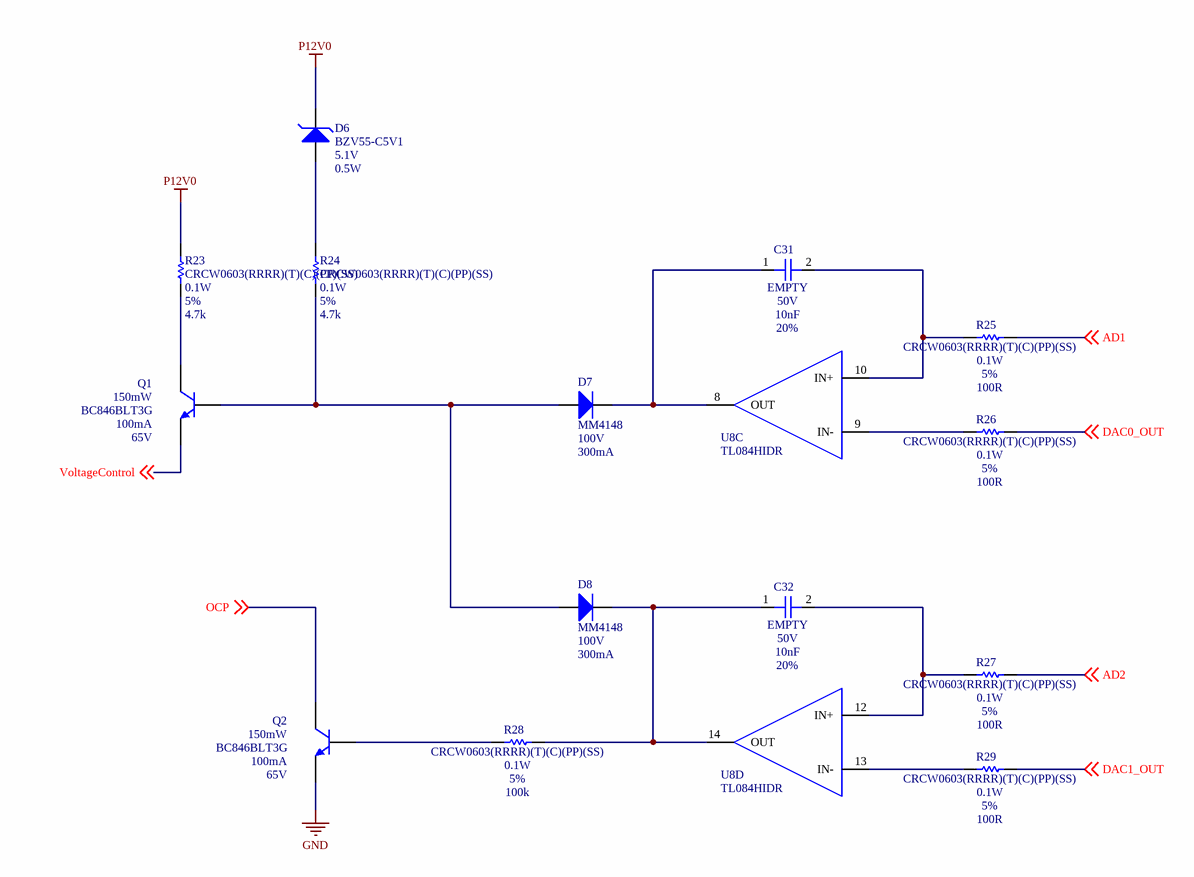
[diagram p6: STM3205P_VoltageControl.SchDoc]

### Parts
C31  value 10nF  PartNumber1: EMPTY  Voltage: 50V  Tolerance: 20%  [CAP0603]  (hidden comment: CC0603)
C32  value 10nF  PartNumber1: EMPTY  Voltage: 50V  Tolerance: 20%  [CAP0603]  (hidden comment: CC0603)
D6  value 5.1V  Power: 0.5W  [SOD-80C]  (hidden comment: BZV55-C5V1)
D7  Vrrm: 100V  If: 300mA  [SOD-80C]  (hidden comment: MM4148)
D8  Vrrm: 100V  If: 300mA  [SOD-80C]  (hidden comment: MM4148)
Q1  Power: 150mW  PartNumber1: BC846BLT3G  Ic: 100mA  Vce: 65V  [SOT-23]  (hidden comment: BC846B)
Q2  Power: 150mW  PartNumber1: BC846BLT3G  Ic: 100mA  Vce: 65V  [SOT-23]  (hidden comment: BC846B)
R23  value 4.7k  PartNumber1: CRCW0603(RRRR)(T)(C)(PP)(SS)  Power: 0.1W  Tolerance: 5%  [RES0603]  (hidden comment: Chip Resistor)
R24  value 4.7k  PartNumber1: CRCW0603(RRRR)(T)(C)(PP)(SS)  Power: 0.1W  Tolerance: 5%  [RES0603]  (hidden comment: Chip Resistor)
R25  value 100R  PartNumber1: CRCW0603(RRRR)(T)(C)(PP)(SS)  Power: 0.1W  Tolerance: 5%  [RES0603]  (hidden comment: Chip Resistor)
R26  value 100R  PartNumber1: CRCW0603(RRRR)(T)(C)(PP)(SS)  Power: 0.1W  Tolerance: 5%  [RES0603]  (hidden comment: Chip Resistor)
R27  value 100R  PartNumber1: CRCW0603(RRRR)(T)(C)(PP)(SS)  Power: 0.1W  Tolerance: 5%  [RES0603]  (hidden comment: Chip Resistor)
R28  value 100k  PartNumber1: CRCW0603(RRRR)(T)(C)(PP)(SS)  Power: 0.1W  Tolerance: 5%  [RES0603]  (hidden comment: Chip Resistor)
R29  value 100R  PartNumber1: CRCW0603(RRRR)(T)(C)(PP)(SS)  Power: 0.1W  Tolerance: 5%  [RES0603]  (hidden comment: Chip Resistor)
U8  TL084HIDR  [SOIC-14-3.9mm]  (parts C,D of 4)

### Nets
GND: Q2.2(E)
P12V0: D6.K R23.2
AD1: R25.2 ; off-sheet AD1
AD2: R27.2 ; off-sheet AD2
DAC0_OUT: R26.2 ; off-sheet DAC0_OUT
DAC1_OUT: R29.2 ; off-sheet DAC1_OUT
OCP: Q2.3(C) ; off-sheet OCP
VoltageControl: Q1.2(E) ; off-sheet VoltageControl
NetC31_1: C31.1 D7.K U8.8(OUT)
NetC31_2: C31.2 R25.1 U8.10(IN+)
NetC32_1: C32.1 D8.K R28.2 U8.14(OUT)
NetC32_2: C32.2 R27.1 U8.12(IN+)
NetD6_A: D6.A R24.2
NetD7_A: D7.A D8.A Q1.1(B) R24.1
NetQ1_3: Q1.3(C) R23.1
NetQ2_1: Q2.1(B) R28.1
NetR26_1: R26.1 U8.9(IN-)
NetR29_1: R29.1 U8.13(IN-)

### Notes on the sheet
- Title
- Author
- Checked By
- Variant
- Size:
- Revision:
- A3
- Date:
- Project
- Time:
- Sheet
- of
- File:

### Library data of the parts
C31 C32 = CC0603: as C1 on sheet STM3205P_PowerSupply; Published: 19-Jun-2016; LatestRevisionDate: 19-Jun-2016; Publisher: Lucas Moraes; PackageReference: CAP0603; PackageDescription: CAP0603;2 Leads
D6 = BZV55-C5V1: Zener Diodes 5.1V 0.5W; Manufacturer1: Nexperia; Published: 02-May-2024; LatestRevisionDate: 02-May-2024; PackageReference: SOD-80C; Publisher: Lucas Moraes; PackageDescription: SOD-80C; 2 Leads; PartNumber1: BZV55-C5V1
D7 D8 = MM4148: General Purpose Plastic Rectifier; Vf: 1.0V; Published: 11-May-2016; LatestRevisionDate: 11-May-2016; PackageReference: SOD-80C; Publisher: Lucas Moraes; PackageDescription: SOD-80C; 2 Leads; PartNumber1: MM4148
Q1 Q2 = BC846B: Transistor BJT NPN 65V 0.1A 150mW; Manufacturer1: onsemi; hFe: 300; Published: 20-Sep-2018; LatestRevisionDate: 20-Sep-2018; PackageReference: SOT23; Publisher: Lucas Moraes; PackageDescription: SOT23; 3Leads; LatestRevisionNote: Created
R23-R29 = CRCW0603: as R1 on sheet STM3205P_Controller; LatestRevisionDate: 06-May-2016; PackageReference: 0603; Publisher: Lucas Moraes; PackageDescription: SMD 0603; 2 Leads; Published: 06-May-2016
U8 = TL084HIDR: as U8 on sheet STM3205P_VoltageMeasure; Published: 27-Aug-2025; LatestRevisionDate: 27-Aug-2025; LatestRevisionNote: Created; PackageReference: SOIC14; Publisher: Lucas Moraes; PackageDescription: SOIC14; 14 Leads; Datasheet: https://www.ti.com/lit/ds/symlink/tl084.pdf; PartNumber1: TL084HIDR

## Sheet STM3205P_DigitalOutputs.SchDoc
size A3; Author: Lucas da Silva; DrawnBy: Lucas da Silva; Engineer: Lucas da Silva; Organization: Canis Tech; Address1: -; Address2: -; Address3: -; Address4: Indaiatuba/SP; DocumentNumber: 9; Revision: 1.1; SheetNumber: 9; SheetTotal: 9; Address5: Brazil
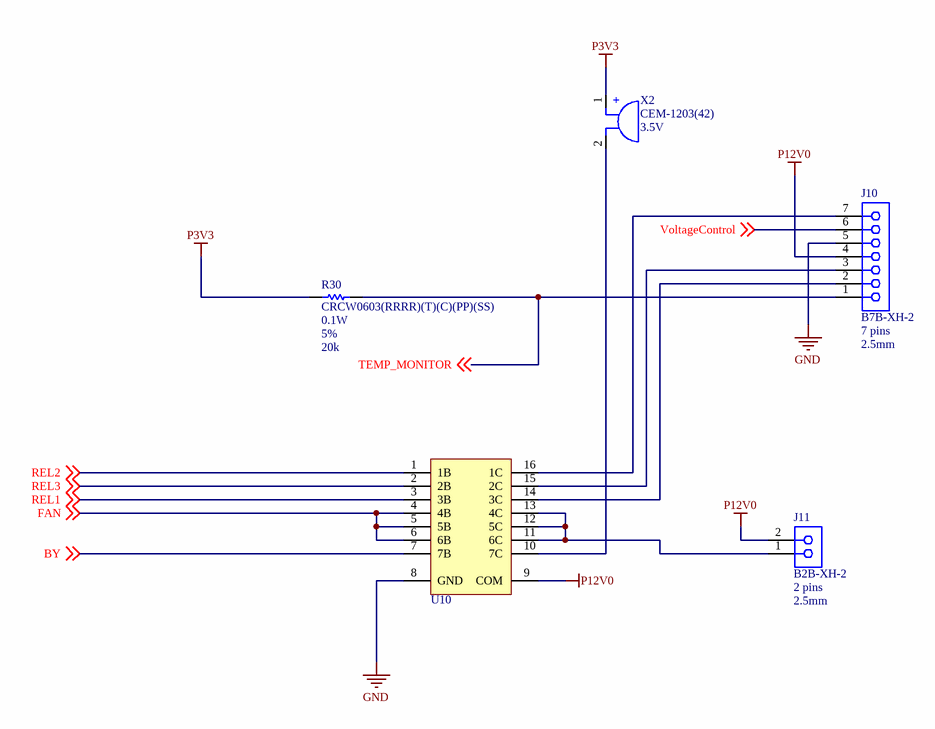
[diagram p7: STM3205P_DigitalOutputs.SchDoc]

### Parts
J10  Pins: 7 pins  Pitch: 2.5mm  [CONXH07STRMALE_2.5]  (hidden comment: B7B-XH-2)
J11  Pins: 2 pins  Pitch: 2.5mm  [CONXH02STRMALE_2.5]  (hidden comment: B2B-XH-2)
R30  value 20k  PartNumber1: CRCW0603(RRRR)(T)(C)(PP)(SS)  Power: 0.1W  Tolerance: 5%  [RES0603]  (hidden comment: Chip Resistor)
U10  ULN2003ADR  [SOIC-16-3.9mm]  (value not drawn)
X2  value 3.5V  [CEM-1203]  (hidden comment: CEM-1203(42))

### Nets
GND: J10.5 U10.8(GND)
P3V3: R30.2 X2.1(+)
P12V0: J10.4 J11.2 U10.9(COM)
BY: U10.7(7B) ; off-sheet BY
FAN: U10.4(4B) U10.5(5B) U10.6(6B) ; off-sheet FAN
REL1: U10.3(3B) ; off-sheet REL1
REL2: U10.1(1B) ; off-sheet REL2
REL3: U10.2(2B) ; off-sheet REL3
TEMP_MONITOR: J10.1 R30.1 ; off-sheet TEMP_MONITOR
VoltageControl: J10.6 ; off-sheet VoltageControl
NetJ10_2: J10.2 U10.14(3C)
NetJ10_3: J10.3 U10.15(2C)
NetJ10_7: J10.7 U10.16(1C)
NetJ11_1: J11.1 U10.11(6C) U10.12(5C) U10.13(4C)
NetU10_10: U10.10(7C) X2.2(-)

### Notes on the sheet
- Title
- Author
- Checked By
- Variant
- Size:
- Revision:
- A3
- Date:
- Project
- Time:
- Sheet
- of
- File:

### Library data of the parts
J10 = B7B-XH-2: XH Connector 7 POS HDR VERT 2.5mm; Manufacturer1: JST; LastRevisionNote: Created; Gender: Male; Published: 04-Oct-2025; LatestRevisionDate: 04-Oct-2025; PackageReference: CONXH07STRMALE_2.5; Publisher: Lucas Moraes; PackageDescription: CONXH07STRMALE_2.5; 7 Leads; Type: Pin; PartNumber1: B7B-XH-2
J11 = B2B-XH-2: as J7 on sheet STM3205P_VoltageMeasure; Published: 04-Oct-2025; LatestRevisionDate: 04-Oct-2025; PackageReference: CONXH02STRMALE_2.5; Publisher: Lucas Moraes; PackageDescription: CONXH02STRMALE_2.5; 2 Leads; Type: Pin; PartNumber1: B2B-XH-2
R30 = CRCW0603: as R1 on sheet STM3205P_Controller; LatestRevisionDate: 06-May-2016; PackageReference: 0603; Publisher: Lucas Moraes; PackageDescription: SMD 0603; 2 Leads; Published: 06-May-2016
U10 = ULN2003ADR: Darlington Transistors Arrays NPN 7-Ch; Manufacturer1: Texas Instruments; Published: 15-Oct-2023; LatestRevisionDate: 15-Oct-2023; LatestRevisionNote: Created; PackageReference: SOIC-16-3.9mm; Publisher: Lucas Moraes; PackageDescription: SOIC-16-3.9mm; 16 Leads; PartNumber1: ULN2003ADR
X2 = CEM-1203(42): 12 mm, 3.5 Vo-p, 95 dB, Through Hole, Magnetic Audio Transducer Buzzer; Manufacturer1: Same Sky; Published: 05-Oct-2025; LatestRevisionDate: 05-Oct-2025; Publisher: Lucas Moraes; PackageReference: CEM-1203; PackageDescription: CEM-1203;2 Leads; Datasheet: https://www.mouser.com/datasheet/3/6118/1/cem-1203-42-.pdf; PartNumber1: CEM-1203(42)

## Nets that join several sheets
GND: STM3205P_Connectors (J1.2 J2.1 J3.1 J4.2), STM3205P_PowerSupply (14 pins), STM3205P_Controller (17 pins), STM3205P_DACSPI (12 pins), STM3205P_VoltageMeasure (C25.2 R4.2), STM3205P_CurrentMeasure (7 pins), STM3205P_VoltageControl (Q2.2), STM3205P_DigitalOutputs (J10.5 U10.8)
N12V0: STM3205P_PowerSupply (CE4.2 U2.3), STM3205P_CurrentMeasure (C29.2 U8.11)
P3V3: STM3205P_Connectors (J2.4 J4.1 J4.7), STM3205P_PowerSupply (C6.1 U4.2 U4.4), STM3205P_Controller (12 pins), STM3205P_DACSPI (6 pins), STM3205P_VoltageMeasure (R5.2 R6.2), STM3205P_CurrentMeasure (R17.2 R18.2), STM3205P_DigitalOutputs (R30.2 X2.1)
P12V0: STM3205P_PowerSupply (CE2.1 U1.3), STM3205P_CurrentMeasure (C27.2 U8.4), STM3205P_VoltageControl (D6.K R23.2), STM3205P_DigitalOutputs (J10.4 J11.2 U10.9)
+15VAC: STM3205P_Connectors (J1.1), STM3205P_PowerSupply (D1.A D3.K)
-15VAC: STM3205P_Connectors (J1.3), STM3205P_PowerSupply (D2.A D4.K)
AD1: STM3205P_VoltageMeasure (C22.1 R9.2 R13.1 U8.7), STM3205P_VoltageControl (R25.2)
AD1F: STM3205P_Controller (U5.11), STM3205P_VoltageMeasure (C25.1 R6.1 R9.1)
AD2: STM3205P_CurrentMeasure (C30.1 R20.2 R22.1 U8.1), STM3205P_VoltageControl (R27.2)
AD2F: STM3205P_Controller (U5.12), STM3205P_CurrentMeasure (C28.1 R18.1 R20.1)
BkeyLeft: STM3205P_Connectors (J3.9), STM3205P_Controller (U5.2)
BkeyRight: STM3205P_Connectors (J3.10), STM3205P_Controller (U5.46)
BY: STM3205P_Controller (U5.33), STM3205P_DigitalOutputs (U10.7)
DAC0_OUT: STM3205P_DACSPI (U6.1), STM3205P_VoltageControl (R26.2)
DAC1_OUT: STM3205P_DACSPI (U7.1), STM3205P_VoltageControl (R29.2)
DAC_CS0: STM3205P_Controller (U5.16), STM3205P_DACSPI (U6.4)
DAC_CS1: STM3205P_Controller (U5.14), STM3205P_DACSPI (U7.4)
DAC_SCLK: STM3205P_Controller (U5.15), STM3205P_DACSPI (U6.5 U7.5)
DAC_SPI: STM3205P_Controller (U5.17), STM3205P_DACSPI (U6.6 U7.6)
display1: STM3205P_Connectors (J4.8), STM3205P_Controller (U5.25)
display2: STM3205P_Connectors (J4.9), STM3205P_Controller (U5.26)
display3: STM3205P_Connectors (J4.10), STM3205P_Controller (U5.27)
display4: STM3205P_Connectors (J4.11), STM3205P_Controller (U5.28)
display5: STM3205P_Connectors (J4.12), STM3205P_Controller (U5.29)
FAN: STM3205P_Controller (U5.32), STM3205P_DigitalOutputs (U10.4 U10.5 U10.6)
key_in1: STM3205P_Connectors (J3.2), STM3205P_Controller (U5.41)
key_in2: STM3205P_Connectors (J3.4), STM3205P_Controller (U5.42)
key_in3: STM3205P_Connectors (J3.3), STM3205P_Controller (U5.10)
key_out1: STM3205P_Connectors (J3.6), STM3205P_Controller (U5.43)
key_out2: STM3205P_Connectors (J3.5), STM3205P_Controller (U5.4)
key_out3: STM3205P_Connectors (J3.8), STM3205P_Controller (U5.45)
key_out4: STM3205P_Connectors (J3.7), STM3205P_Controller (U5.3)
OCP: STM3205P_Controller (U5.18), STM3205P_VoltageControl (Q2.3)
REL1: STM3205P_Controller (U5.38), STM3205P_DigitalOutputs (U10.3)
REL2: STM3205P_Controller (U5.40), STM3205P_DigitalOutputs (U10.1)
REL3: STM3205P_Controller (U5.39), STM3205P_DigitalOutputs (U10.2)
RXD: STM3205P_Connectors (J2.2), STM3205P_Controller (U5.31)
SD2: STM3205P_Connectors (J4.6), STM3205P_Controller (U5.22)
SHCP2: STM3205P_Connectors (J4.4), STM3205P_Controller (U5.21)
STCP2: STM3205P_Connectors (J4.3), STM3205P_Controller (U5.19)
TEMP_MONITOR: STM3205P_Controller (U5.13), STM3205P_DigitalOutputs (J10.1 R30.1)
TXD: STM3205P_Connectors (J2.3), STM3205P_Controller (U5.30)
VoltageControl: STM3205P_VoltageControl (Q1.2), STM3205P_DigitalOutputs (J10.6)

## Assembly variants
Main: all parts fitted